# Altium schematic sheet CW308T_S6LX9_Connector.SchDoc: CW308 Connections
size Letter; Organization: NewAE Technology Inc.; Address1: 1083 Queen St., Suite 196; Address2: Halifax; Address3: NS; Address4: Canada B3H 0B2; SheetNumber: 1; SheetTotal: 3; SheetApproved: Yes
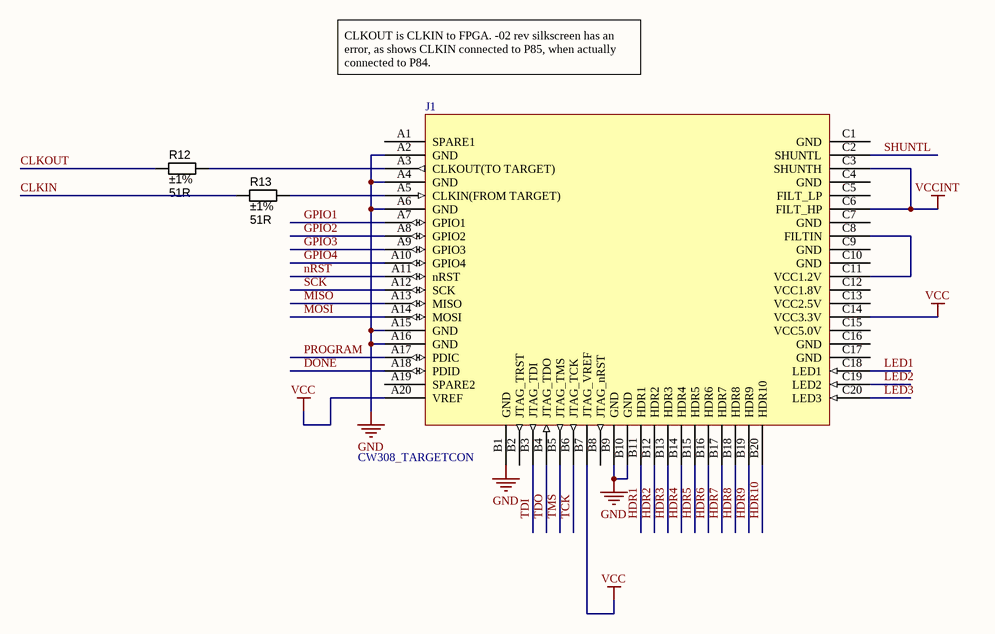
[diagram p0: CW308T_S6LX9_Connector.SchDoc]

## Parts
J1  CW308_TARGETCON  [CW308_TBOARD_CONN]
R12  value 51R  Tolerance: ±1%  [RESC1608X55N]  (hidden comment: Thick Film)
R13  value 51R  Tolerance: ±1%  [RESC1608X55N]  (hidden comment: Thick Film)

## Nets
GND: J1.A2(GND) J1.A4(GND) J1.A6(GND) J1.A15(GND) J1.A16(GND) J1.B1(GND) J1.B9(GND) J1.B10(GND)
VCC: J1.A20(VREF) J1.B7(JTAG_VREF) J1.C14(VCC3.3V)
VCCINT: J1.C3(SHUNTH) J1.C6(FILT_HP)
CLKIN: R13.1
CLKOUT: R12.1
DONE: J1.A18(PDID)
GPIO1: J1.A7(GPIO1)
GPIO2: J1.A8(GPIO2)
GPIO3: J1.A9(GPIO3)
GPIO4: J1.A10(GPIO4)
HDR1: J1.B11(HDR1)
HDR2: J1.B12(HDR2)
HDR3: J1.B13(HDR3)
HDR4: J1.B14(HDR4)
HDR5: J1.B15(HDR5)
HDR6: J1.B16(HDR6)
HDR7: J1.B17(HDR7)
HDR8: J1.B18(HDR8)
HDR9: J1.B19(HDR9)
HDR10: J1.B20(HDR10)
LED1: J1.C18(LED1)
LED2: J1.C19(LED2)
LED3: J1.C20(LED3)
MISO: J1.A13(MISO)
MOSI: J1.A14(MOSI)
nRST: J1.A11(nRST)
PROGRAM: J1.A17(PDIC)
SCK: J1.A12(SCK)
SHUNTL: J1.C2(SHUNTL)
TCK: J1.B6(JTAG_TCK)
TDI: J1.B3(JTAG_TDI)
TDO: J1.B4(JTAG_TDO)
TMS: J1.B5(JTAG_TMS)
NetJ1_A3: J1.A3(CLKOUT(TO_TARGET)) R12.2
NetJ1_A5: J1.A5(CLKIN(FROM_TARGET)) R13.2
NetJ1_C8: J1.C8(FILTIN) J1.C11(VCC1.2V)

Not connected (* = marked no-connect by the designer): J1 A1(SPARE1) A19(SPARE2) B2(JTAG_TRST) B8(JTAG_nRST) C1(GND) C4(GND) C5(FILT_LP) C7(GND) C9(GND) C10(GND) C12(VCC1.8V) C13(VCC2.5V) C15(VCC5.0V) C16(GND) C17(GND)

## Notes on the sheet
- CLKOUT is CLKIN to FPGA. -02 rev silkscreen has an error, as shows CLKIN connected to P85, when actually connected to P84.
- Title:
- Date:
- Rev:
- Time:
- Project:
- Sheet
- of
- License:
- Copyright © NewAE Technology Inc.
- Approved:
- NewAE.com
- File:

## Library data of the parts
J1 = CW308_TBOARD: CW308 "Standard" Target Board Connector
R12 R13 = RES_51R_0603_1%: Resistor SMD chip 51 Ohm 0.1W 1% 0603; Manufacturer 1: Yageo; Manufacturer Part Number 1: RC0603FR-0751RL; Ratings: 1/10 W; SCDType: spec; Package / Case: 0603 (1608 metric); Material: Thick Film; Supplier 1: Digi-Key; Supplier Part Number 1: 311-51.0HRCT-ND